# Altium schematic sheet MDQARM_MCU.SchDoc
size A3; Organization: Altium Limited; Address1: L3, 12a Rodborough Rd; Address2: Frenchs Forest; Address3: NSW; Address4: Australia 2086
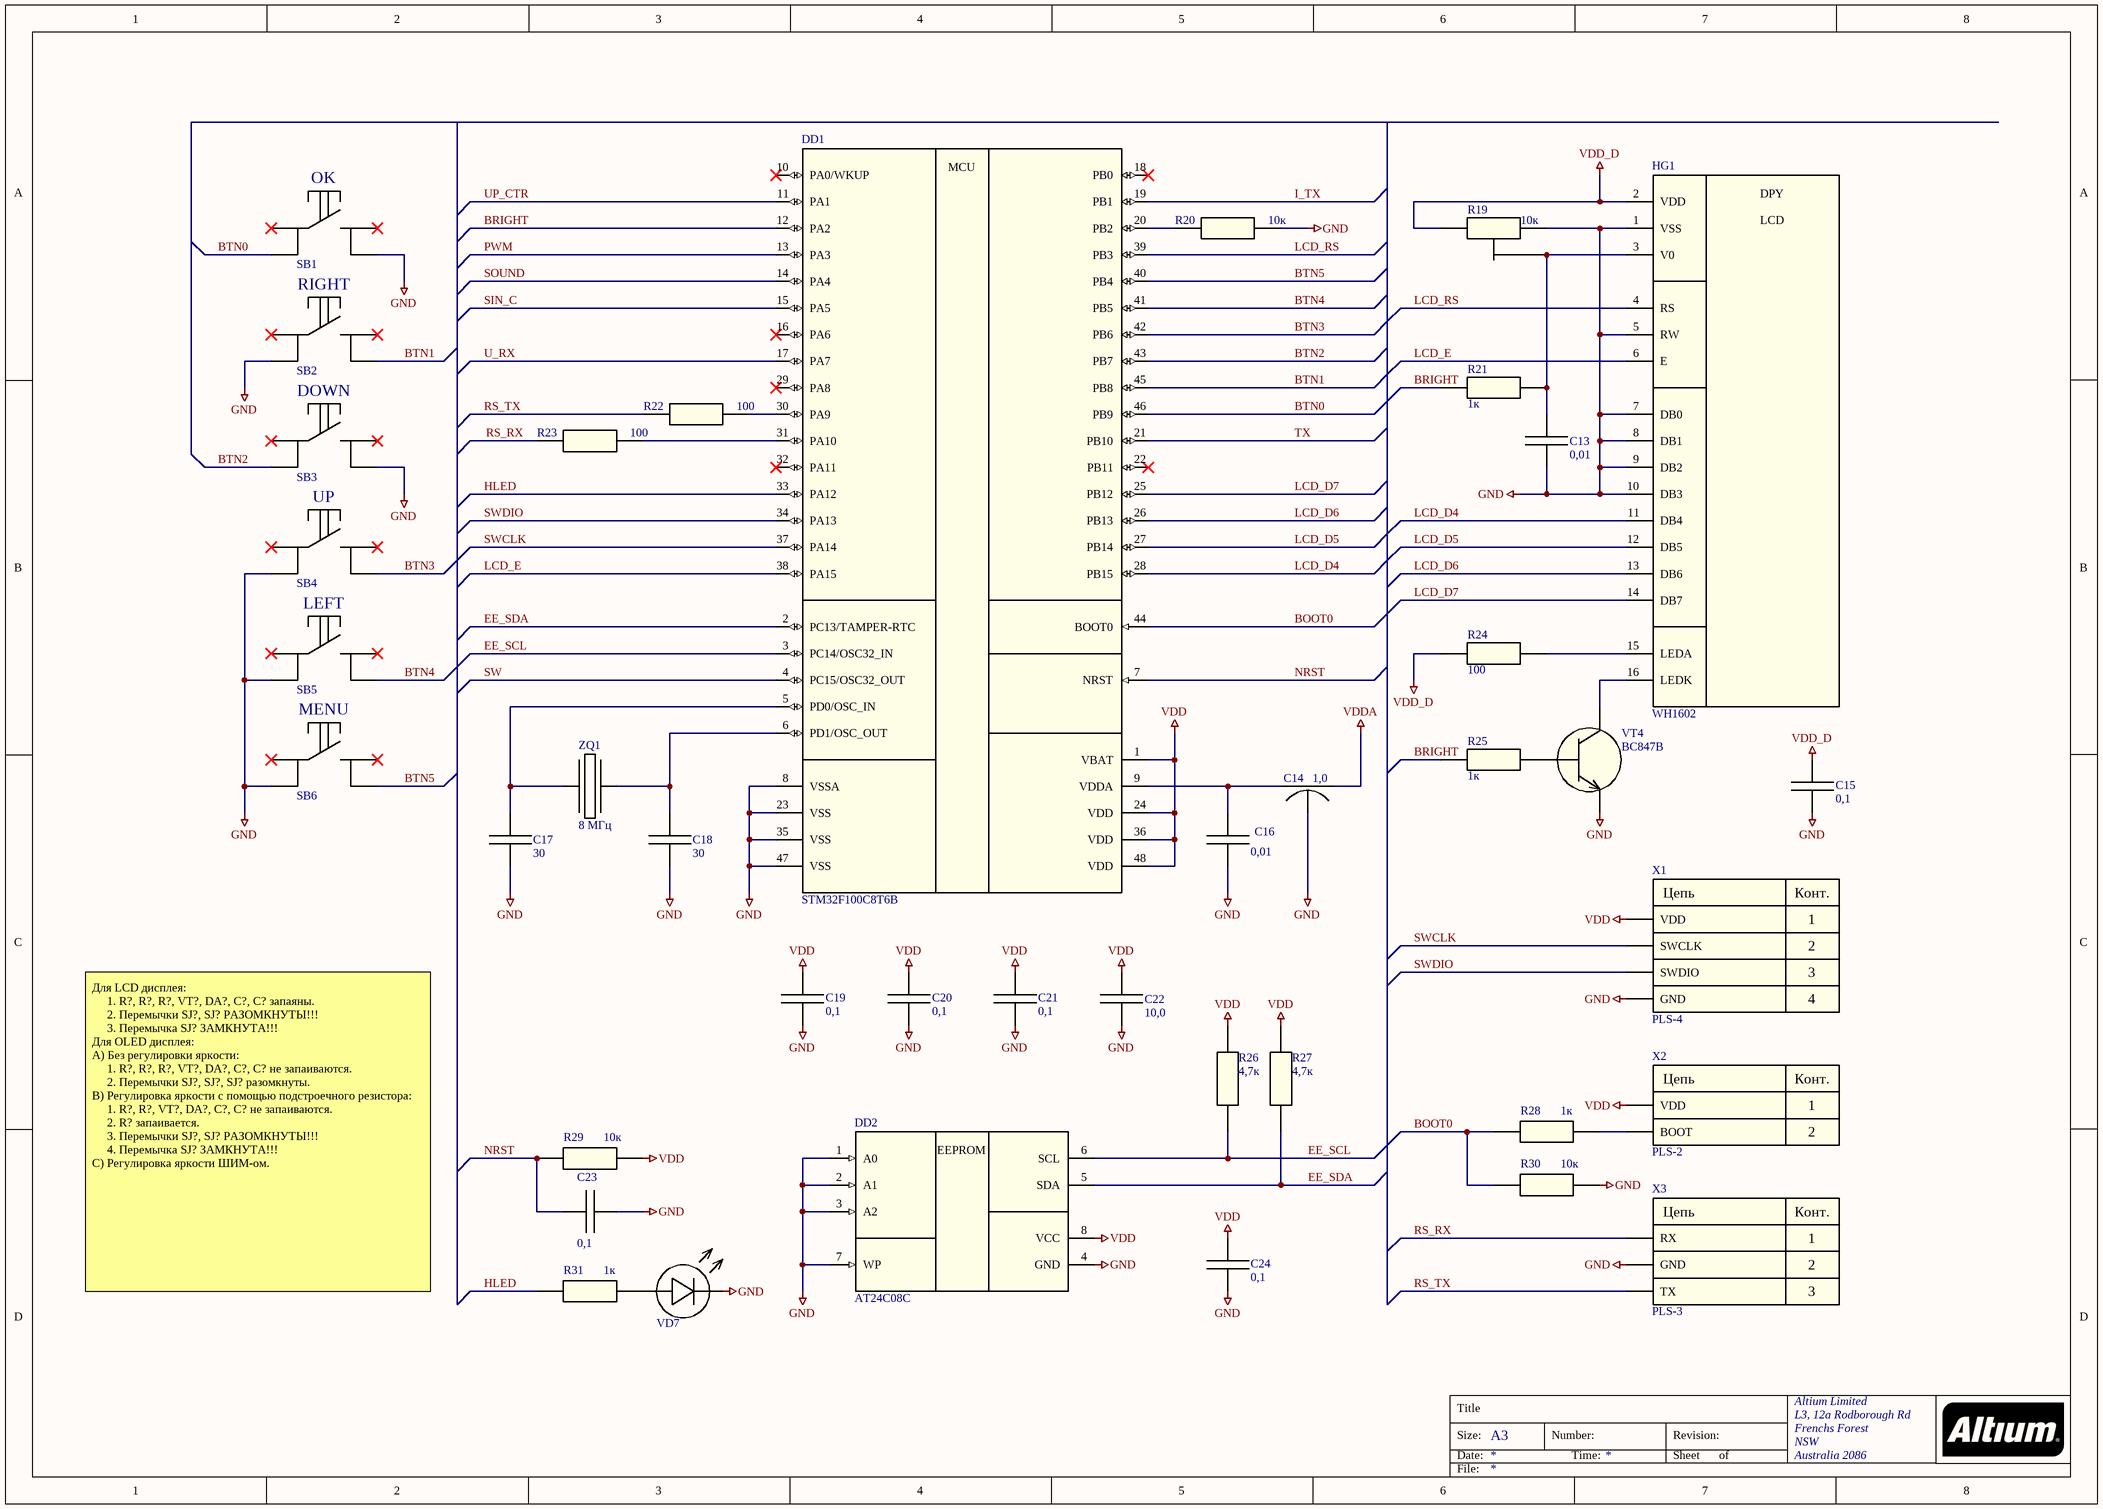
[diagram p0: MDQARM_MCU.SchDoc]

## Parts
C13  0,01  [Capacitor SMD0805-T0.75]
C14  1,0  [Filter NFM21PC]
C15  0,1  [Capacitor SMD0805-T0.95]
C16  0,01  [Capacitor SMD0805-T0.75]
C17  30  [Capacitor SMD0805-T0.75]
C18  30  [Capacitor SMD0805-T0.75]
C19  0,1  [Capacitor SMD0805-T0.95]
C20  0,1  [Capacitor SMD0805-T0.95]
C21  0,1  [Capacitor SMD0805-T0.95]
C22  10,0  [Capacitor SMD0805-T1.35]
C23  0,1  [Capacitor SMD0805-T0.95]
C24  0,1  [Capacitor SMD0805-T0.95]
DD1  STM32F100C8T6B  [IC STM32F100C8T6B]
DD2  AT24C08C  [IC AT24C08C]
HG1  WH1602  [Indicator WH1602]
R19  10к  [Resistor 3303X-3]
R20  10к  [Resistor SMD0805]
R21  1к  [Resistor SMD0805]
R22  100  [Resistor SMD0805]
R23  100  [Resistor SMD0805]
R24  100  [Resistor SMD0805]
R25  1к  [Resistor SMD0805]
R26  4,7к  [Resistor SMD0805]
R27  4,7к  [Resistor SMD0805]
R28  1к  [Resistor SMD0805]
R29  10к  [Resistor SMD0805]
R30  10к  [Resistor SMD0805]
R31  1к  [Resistor SMD0805]
SB1  KLS7-TS6604-4.3-180  [Button KLS7-TS6604-4.3-180]  (value not drawn)
SB2  KLS7-TS6604-4.3-180  [Button KLS7-TS6604-4.3-180]  (value not drawn)
SB3  KLS7-TS6604-4.3-180  [Button KLS7-TS6604-4.3-180]  (value not drawn)
SB4  KLS7-TS6604-4.3-180  [Button KLS7-TS6604-4.3-180]  (value not drawn)
SB5  KLS7-TS6604-4.3-180  [Button KLS7-TS6604-4.3-180]  (value not drawn)
SB6  KLS7-TS6604-4.3-180  [Button KLS7-TS6604-4.3-180]  (value not drawn)
VD7  RED  [Diode SMD0805]  (value not drawn)
VT4  BC847B  [Transistor SOT23]
X1  PLS-4  [Connector PLS-4]
X2  PLS-2  [Connector PLS-2]
X3  PLS-3  [Connector PLS-3]
ZQ1  8 МГц  [Quartz HC-49SM]

## Nets
GND: C13.1 C14.2 C15.1 C16.1 C17.1 C18.1 C19.1 C20.1 C21.1 C22.1 C23.2 C24.1 DD1.8(VSSA) DD1.23(VSS) DD1.35(VSS) DD1.47(VSS) DD2.1(A0) DD2.2(A1) DD2.3(A2) DD2.4(GND) DD2.7(WP) HG1.1(VSS) HG1.5(RW) HG1.7(DB0) HG1.8(DB1) HG1.9(DB2) HG1.10(DB3) R19.3 R20.2 R30.2 SB1.3 SB2.2 SB3.3 SB4.2 SB5.2 SB6.2 VD7.2(C) VT4.2(E) X1.4(GND) X3.2(GND)
VDD: C19.2 C20.2 C21.2 C22.2 C24.2 DD1.1(VBAT) DD1.24(VDD) DD1.36(VDD) DD1.48(VDD) DD2.8(VCC) R26.2 R27.2 R29.2 X1.1(VDD) X2.1(VDD)
VDD_D: C15.2 HG1.2(VDD) R19.1 R24.2
VDDA: C14.3
BOOT0: DD1.44(BOOT0) R28.1 R30.1
BRIGHT: DD1.12(PA2) R21.1 R25.2
BTN0: DD1.46(PB9) SB1.2
BTN1: DD1.45(PB8) SB2.3
BTN2: DD1.43(PB7) SB3.2
BTN3: DD1.42(PB6) SB4.3
BTN4: DD1.41(PB5) SB5.3
BTN5: DD1.40(PB4) SB6.3
EE_SCL: DD1.3(PC14/OSC32_IN) DD2.6(SCL) R26.1
EE_SDA: DD1.2(PC13/TAMPER-RTC) DD2.5(SDA) R27.1
HLED: DD1.33(PA12) R31.1
I_TX: DD1.19(PB1)
LCD_D4: DD1.28(PB15) HG1.11(DB4)
LCD_D5: DD1.27(PB14) HG1.12(DB5)
LCD_D6: DD1.26(PB13) HG1.13(DB6)
LCD_D7: DD1.25(PB12) HG1.14(DB7)
LCD_E: DD1.38(PA15) HG1.6(E)
LCD_RS: DD1.39(PB3) HG1.4(RS)
NRST: C23.1 DD1.7(NRST) R29.1
PWM: DD1.13(PA3)
RS_RX: R23.1 X3.1(RX)
RS_TX: R22.1 X3.3(TX)
SIN_C: DD1.15(PA5)
SOUND: DD1.14(PA4)
SW: DD1.4(PC15/OSC32_OUT)
SWCLK: DD1.37(PA14) X1.2(SWCLK)
SWDIO: DD1.34(PA13) X1.3(SWDIO)
TX: DD1.21(PB10)
U_RX: DD1.17(PA7)
UP_CTR: DD1.11(PA1)
NetC13_2: C13.2 HG1.3(V0) R19.2 R21.2
NetC14_1: C14.1 C16.2 DD1.9(VDDA)
NetC17_2: C17.2 DD1.5(PD0/OSC_IN) ZQ1.1
NetC18_2: C18.2 DD1.6(PD1/OSC_OUT) ZQ1.2
NetDD1_20: DD1.20(PB2) R20.1
NetDD1_30: DD1.30(PA9) R22.2
NetDD1_31: DD1.31(PA10) R23.2
NetHG1_15: HG1.15(LEDA) R24.1
NetHG1_16: HG1.16(LEDK) VT4.3(C)
NetR25_1: R25.1 VT4.1(B)
NetR28_2: R28.2 X2.2(BOOT)
NetR31_2: R31.2 VD7.1(A)

Not connected (* = marked no-connect by the designer): DD1 10(PA0/WKUP)* 16(PA6)* 18(PB0)* 22(PB11)* 29(PA8)* 32(PA11)*; SB1 1* 4*; SB2 1* 4*; SB3 1* 4*; SB4 1* 4*; SB5 1* 4*; SB6 1* 4*

## Notes on the sheet
- (near SB1) OK
- (near SB1) RIGHT
- (near SB2) DOWN
- (near SB3) UP
- (near SB4) LEFT
- (near SB5) MENU
- Для LCD дисплея:
  1. R?, R?, R?, VT?, DA?, C?, C? запаяны.
  2. Перемычки SJ?, SJ? РАЗОМКНУТЫ!!!
  3. Перемычка SJ? ЗАМКНУТА!!!
  Для OLED дисплея:
  A) Без регулировки яркости:
  1. R?, R?, R?, VT?, DA?, C?, C? не запаиваются.
  2. Перемычки SJ?, SJ?, SJ? разомкнуты.
  B) Регулировка яркости с помощью подстроечного резистора:
  1. R?, R?, VT?, DA?, C?, C? не запаиваются.
  2. R? запаивается.
  3. Перемычки SJ?, SJ? РАЗОМКНУТЫ!!!
  4. Перемычка SJ? ЗАМКНУТА!!!
  C) Регулировка яркости ШИМ-ом.
- Title
- Size:
- Date:
- A3
- Number:
- Time:
- Revision:
- Sheet
- of
- File:
- (in symbol Connector BOOT) Цепь; Конт.
- (in symbol Connector SWD) Цепь; Конт.
- (in symbol Connector UART) Цепь; Конт.
- (in symbol IC AT24C08C) EEPROM
- (in symbol IC STM32F100C8T6B) MCU
- (in symbol Indicator WH1602) DPY; LCD

## Library data of the parts
C13 C16 = Capacitor C0805_10n: Value: 0,01
C14 = Filter NFM21PC105B1С3D: Value: 1,0
C15 C19-C21 C23 C24 = Capacitor C0805_100n: Value: 0,1
C17 C18 = Capacitor C0805_30p: Value: 30
C22 = Capacitor C0805_10u: Value: 10,0
DD1 = IC STM32F100C8T6B: Value: STM32F100C8T6B
DD2 = IC AT24C08C: Value: AT24C08C
HG1 = Indicator WH1602: Value: WH1602
R19 = Resistor 3303X-3-103_10k_25%: Value: 10к
R20 R29 R30 = Resistor R0805_10k_5%: Value: 10к
R21 R25 R28 R31 = Resistor R0805_1k_5%: Value: 1к
R22-R24 = Resistor R0805_100_5%: Value: 100
R26 R27 = Resistor R0805_4.7k_5%: Value: 4,7к
SB1-SB6 = Button KLS7-TS6604-4.3-180: SMD Tact Switch 4.3mm; Value: KLS7-TS6604-4.3-180
VD7 = Diode LED0805RED: LED Red SMD0805
VT4 = Transistor BC847B: Value: BC847B
X1 = Connector SWD: PLS-4 Connector
X2 = Connector BOOT: PLS-2 Connector
X3 = Connector UART: PLS-3 Connector
ZQ1 = Quartz HC-49SM-8MHz: Value: HC-49SM-8MHz